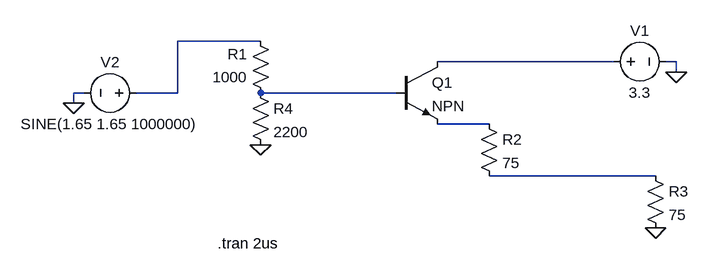
[diagram p0: schematic trans_conv-700mV.asc]
trans_conv-700mV.asc, the LTspice schematic file:
Version 4
SHEET 1 880 680
WIRE -128 80 -256 80
WIRE 416 112 144 112
WIRE 512 112 496 112
WIRE 512 128 512 112
WIRE -400 160 -416 160
WIRE -256 160 -256 80
WIRE -256 160 -320 160
WIRE 80 160 -128 160
WIRE -416 176 -416 160
WIRE 224 208 144 208
WIRE 480 288 224 288
FLAG -416 176 0
FLAG 512 128 0
FLAG 480 368 0
FLAG -128 240 0
SYMBOL voltage 400 112 R270
WINDOW 0 32 56 VTop 2
WINDOW 3 -32 56 VBottom 2
WINDOW 123 0 0 Left 2
WINDOW 39 0 0 Left 2
SYMATTR InstName V1
SYMATTR Value 3.3
SYMBOL voltage -304 160 R90
WINDOW 0 -32 56 VBottom 2
WINDOW 3 32 56 VTop 2
WINDOW 123 0 0 Left 2
WINDOW 39 0 0 Left 2
SYMATTR InstName V2
SYMATTR Value SINE(1.65 1.65 1000000)
SYMBOL res -112 176 R180
WINDOW 0 36 76 Left 2
WINDOW 3 36 40 Left 2
SYMATTR InstName R1
SYMATTR Value 1000
SYMBOL npn 80 112 R0
SYMATTR InstName Q1
SYMBOL res 464 272 R0
SYMATTR InstName R3
SYMATTR Value 75
SYMBOL res 208 192 R0
SYMATTR InstName R2
SYMATTR Value 75
SYMBOL res -144 144 R0
SYMATTR InstName R4
SYMATTR Value 2200
TEXT -194 392 Left 2 !.tran 2us

The netlist it stands for:
* trans_conv-700mV.asc
V1 N002 0 3.3
V2 N001 0 SINE(1.65 1.65 1000000)
R1 N003 N001 1000
Q1 N002 N003 N004 0 NPN
R3 N005 0 75
R2 N004 N005 75
R4 N003 0 2200
.model NPN NPN
.model PNP PNP
.lib standard.bjt
.tran 2us
.backanno
.end